# Altium schematic sheet I2C_Sensors.SchDoc: I2C sensors
size A4; Organization: Use Organization_Name in ProjParam; Address1: EFI & DBR; Address2: STI-IMT-LSRO1; Address3: EPFL; Address4: CH-1015 LAUSANNE; DocumentNumber: 8; Revision: A; SheetNumber: 8; SheetTotal: 2; ApprovedBy: Init ApprovedBy in DocParam; CheckedBy: Init CheckedBy in DocParam; Author: Init Author in DocParam; CompanyName: Init CompanyName in DocParam; DrawnBy: Init DrawBy in DocParam; Engineer: Init Engineer in DocParam; Title2: IMU, TOF & bottom sensors; DocumentName: Init DocumentName in DocParam; ProjectName: Init ProjectName in DocParam
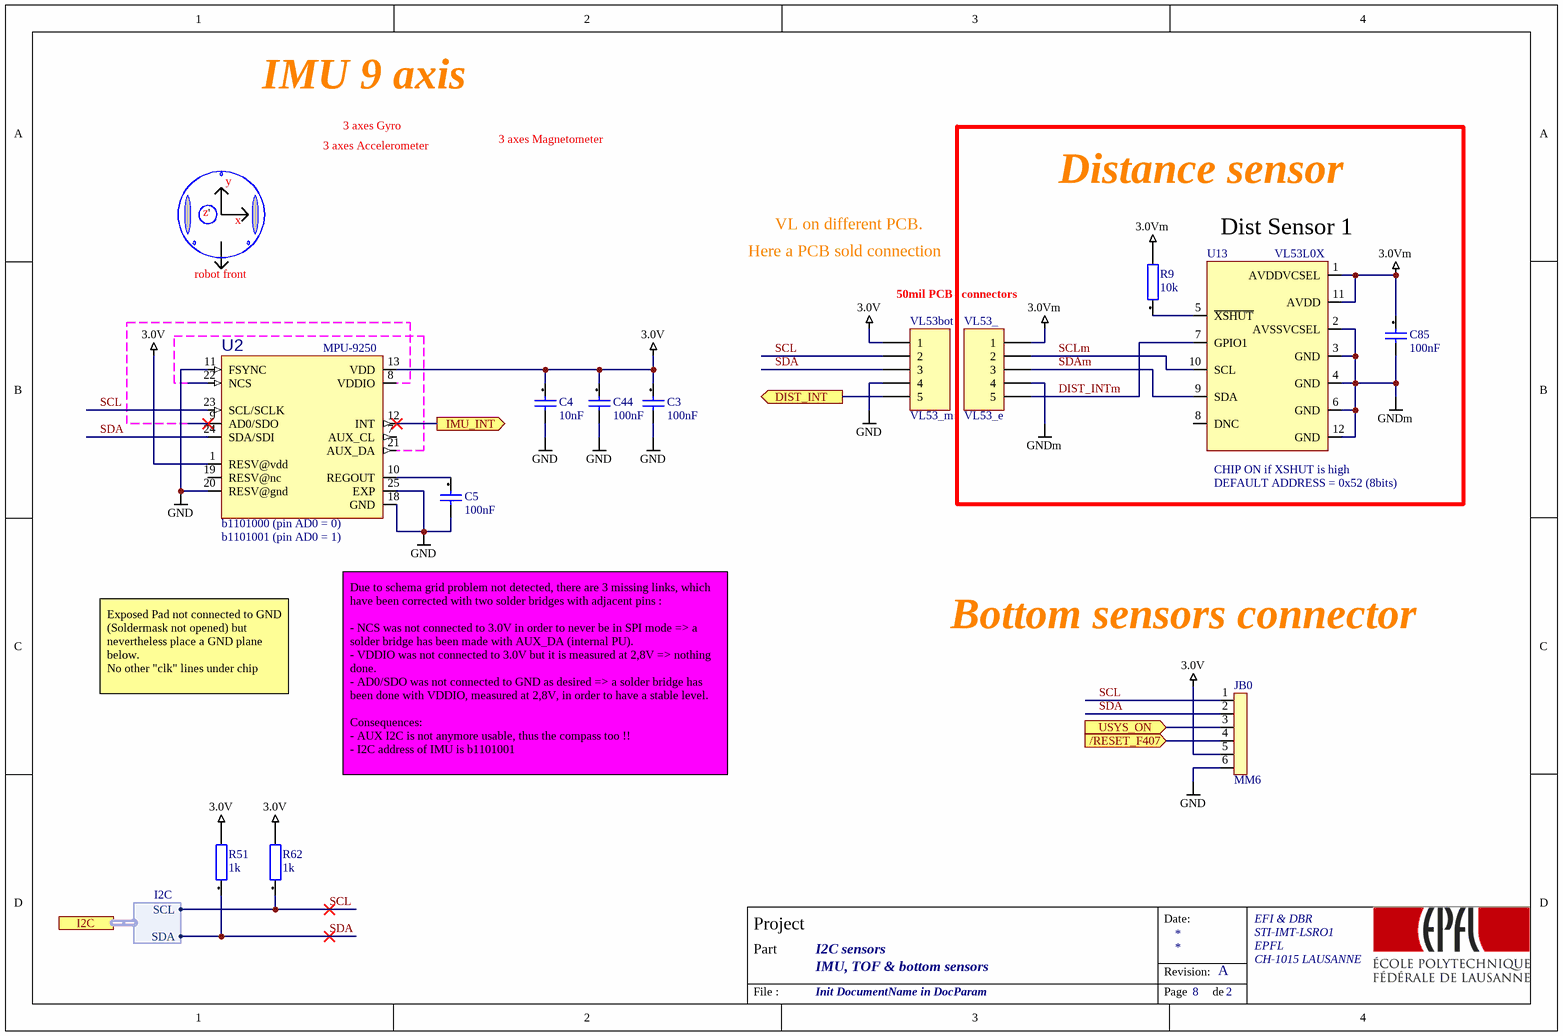
[diagram p0: I2C_Sensors.SchDoc]

## Parts
C3  100nF  [ROB_0603]
C4  10nF  [ROB_0603]
C5  100nF  [ROB_0603]
C44  100nF  [ROB_0603]
C85  100nF  [ROB_0603]
JB0  MM6  [TYCO_7-188275-6]
R9  10k  [ROB_0603]
R51  1k  [ROB_0603]
R62  1k  [ROB_0603]
U2  MPU-9250  [QFN40P300X300X105-25N]
U13  VL53L0X  [VL53L0X]
VL53_  VL53_e  [edge_5_1.25mm_VL53]  (no BOM)
VL53bot  VL53_m  [HDR1X5-0.050"-ver2]  (no BOM)

## Blocks framed on the sheet
Distance sensor: C85 R9 U13 VL53_

## Ports
/RESET_F407 (in), DIST_INT (out), I2C (harness I2C), IMU_INT (out), USYS_ON (in)

## Harnesses
I2C: SDA, SCL

## Nets
3.0V: C3.1 C4.1 C44.1 JB0.5 R51.2 R62.2 U2.1(RESV@vdd) U2.13(VDD) VL53bot.1
3.0Vm: C85.1 R9.2 U13.1(AVDDVCSEL) U13.11(AVDD) VL53_.1
GND: C3.2 C4.2 C5.2 C44.2 JB0.6 U2.11(FSYNC) U2.18(GND) U2.20(RESV@gnd) U2.25(EXP) VL53bot.4
GNDm: C85.2 U13.2(AVSSVCSEL) U13.3(GND) U13.4(GND) U13.6(GND) U13.12(GND) VL53_.4
/RESET_F407: JB0.4 ; port /RESET_F407
DIST_INT: VL53bot.5 ; port DIST_INT
DIST_INTm: U13.7(GPIO1) VL53_.5
IMU_INT: U2.12(INT) ; port IMU_INT
SCL: JB0.1 R62.1 U2.23(SCL/SCLK) VL53bot.2 ; port I2C.SCL
SCLm: U13.10(SCL) VL53_.2
SDA: JB0.2 R51.1 U2.24(SDA/SDI) VL53bot.3 ; port I2C.SDA
SDAm: U13.9(SDA) VL53_.3
USYS_ON: JB0.3 ; port USYS_ON
NetC5_1: C5.1 U2.10(REGOUT)
NetR9_1: R9.1 U13.5(~{XSHUT})

Not connected (* = marked no-connect by the designer): U2 7(AUX_CL) 8(VDDIO) 9(AD0/SDO)* 19(RESV@nc) 21(AUX_DA) 22(NCS); U13 8(DNC)

## Notes on the sheet
- IMU 9 axis
- 3 axes Accelerometer
- 3 axes Gyro
- 3 axes Magnetometer
- z
- '
- y
- x
- VL on different PCB.
- (near U13) Dist Sensor 1
- robot front
- Here a PCB sold connection
- 50mil PCB   connectors
- (near U13) CHIP ON if XSHUT is high
- (near U13) DEFAULT ADDRESS = 0x52 (8bits)
- (near U2) b1101000 (pin AD0 = 0)
- (near U2) b1101001 (pin AD0 = 1)
- Bottom sensors connector
- Exposed Pad not connected to GND (Soldermask not opened) but nevertheless place a GND plane below.
  No other "clk" lines under chip
- Due to schema grid problem not detected, there are 3 missing links, which have been corrected with two solder bridges with adjacent pins :
  - NCS was not connected to 3.0V in order to never be in SPI mode => a solder bridge has been made with AUX_DA (internal PU).
  - VDDIO was not connected to 3.0V but it is measured at 2,8V => nothing done.
  - AD0/SDO was not connected to GND as desired => a solder bridge has been done with VDDIO, measured at 2,8V, in order to have a stable level.
  Consequences:
  - AUX I2C is not anymore usable, thus the compass too !!
  - I2C address of IMU is b1101001
- Date:
- Project
- Part
- Revision:
- File :
- Page
- de

## Library data of the parts
C3 C5 C44 C85 = 100nF[[/\]]0603[[/\]]1: Capacitor; Manufacturer: Kemet; Manufacturer Nr: C0603C104K5RAC; Preference: 1; Tolerance +: +10; Tolerance -: -10; Dielectric: X7R; Voltage: 50; MaxTemperature: +125; MinTemperature: -55; Quant_1: 10; Quant_2: 100; Quant_3: 1000; Quant_4: 4000; Currentie: CHF; Size: 0603; Footprint Acort: 0603_G; Supplier: Farnell; Supplier Nr: 1288255; ComponentLink2Description: Farnell link; ComponentLink2URL: http://ch.farnell.com/jsp/displayProduct.jsp?sku=1288255; Price_1: 0,046; Price_2: 0,04; Price_3: 0,037; Price_4: 0,036; ROHS: True; DateLastUpdate: 2007-12-03 / 14:22:31
  C3 C5 C44: Value: 100nF
C4 = 10nF[[/\]]0603[[/\]]1: Capacitor; Manufacturer: Multicomp; Manufacturer Nr: U0603R103KCT; Preference: 1; Tolerance +: +10; Tolerance -: -10; Dielectric: X7R; Voltage: 50; MaxTemperature: +125; MinTemperature: -55; Quant_1: 10; Quant_2: 100; Quant_3: 1000; Currentie: CHF; Size: 0603; Footprint Acort: 0603_G; Supplier: Farnell; Supplier Nr: 9406182; ComponentLink2Description: Farnell link; ComponentLink2URL: http://ch.farnell.com/jsp/displayProduct.jsp?sku=9406182; Price_1: 0,062; Price_2: 0,041; Price_3: 0,021; ROHS: True; DateLastUpdate: 2007-12-03 / 14:22:34; Value: 10nF
JB0 = MM6FVS[[/\]]1: Micro-Match 6 pins Female on board Vertical Smd connector; Manufacturer: Tyco; Manufacturer Nr: 7-188275-6; Preference: 1; Currentie: CHF; Quant_1: 10; Quant_2: 900; value: farnell 1056234; Footprint Acort: ToDefine; ComponentLink1Description: Datasheet; ComponentLink1URL: http://ecommas.tycoelectronics.com/commerce/DocumentDelivery/DDEController?Action=showdoc&DocId=Customer+Drawing%7F188275%7FR%7Fpdf%7FEnglish%7FC_188275_R.pdf; Supplier: Farnell; Supplier Nr: 1056234; ComponentLink2Description: Farnell link; ComponentLink2URL: http://fr.farnell.com/jsp/displayProduct.jsp?sku=1056234; ROHS: True; Type: SMD; Orientation: Vertical; DateLastUpdate: 2007-12-04 / 09:15:57; Price_1: 1,1; Price_2: 0,924
R9 = 10K[[/\]]0603[[/\]]1: Resistor; Manufacturer: Vishay; Manufacturer Nr: D11CRCW06030B1002F; Tolerance: +/-1; Preference: 1; Power: 0.1; Voltage: 75; Current: 1.5; ppm/K: +/-100; Quant_1: 10; Quant_2: 100; Quant_3: 500; Currentie: CHF; Value: 10k; Size: 0603; Footprint Acort: 0603; ComponentLink1Description: OnLine datasheet; Supplier: Distrelec; Supplier Nr: 715612; ComponentLink2Description: Distrelec link; ComponentLink2URL: http://www.distrelec.com/ishopWebFront/search/luceneSearch.do?dispatch=find&showImage=on&artnrPhrase=715612; ROHS: True; Price_1: 0,0538; Price_2: 0,0323; Price_3: 0,0204; DateLastUpdate: 2007-12-03 / 16:29:57
R51 R62 = 4.7K[[/\]]0603[[/\]]2: Resistor; Manufacturer: Multicomp; Manufacturer Nr: MC 0.063W 0603 1% 4K7; Tolerance: +/-1; Preference: 2; Power: 0.063; Voltage: 50; Current: 1; ppm/K: +/-100; Quant_2: 250; Quant_3: 1000; Quant_4: 5000; Quant_5: 15000; Currentie: CHF; Value: 1k; Size: 0603; Footprint Acort: 0603; Supplier: Farnell; Supplier Nr: 9331247; ComponentLink2Description: Farnell link; ComponentLink2URL: http://ch.farnell.com/jsp/displayProduct.jsp?sku=9331247; ROHS: True; Quant_1: 50; Price_1: 0,062; Price_2: 0,049; Price_3: 0,038; Price_4: 0,027; Price_5: 0,021; DateLastUpdate: 2007-11-29 / 09:28:47
U2 = MPU-9250: SMD Gyroscope/Accelerometer/Magnetometer Sensor; 9-AXIS; Manufacturer: InvenSense; Statut de la pièce: Actif; Type de capteur: Accéléromètre, gyroscope, magnétomètre, 3 axes; Type de sortie: I²C, SPI; Température d’utilisation: -40°C ~ 85°C (TA); Supplier 1: Digi-Key; RoHS: RoHS Compliant; Category: Capteurs, transducteurs; Stock 1: 94102; Pricing 1: 1=10.04, 5=8.812, 10=7.93, 25=7.0488, 50=6.52, 100=5.6389, 500=5.2865, 1000=4.93406 (EUR); ComponentLink1URL: http://store.invensense.com/datasheets/invensense/MPU9250REV1.0.pdf; ComponentLink1Description: http://store.invensense.com/datasheets/invensense/MPU9250REV1.0.pdf; Manufacturer Part Number: MPU-9250; Supplier Part Number 1: 1428-1019-1-ND
U13 = VL53L0X: TOF sensor
VL53_ = Header 5H: edge 5-Pin; LatestRevisionDate: 17-Jul-2002; LatestRevisionNote: Re-released for DXP Platform.; Publisher: Altium Limited
VL53bot = Header 5H: SMD 5-Pin, vertical; LatestRevisionDate: 17-Jul-2002; LatestRevisionNote: Re-released for DXP Platform.; Publisher: Altium Limited